# Altium schematic sheet Dimmer.SchDoc
size A4
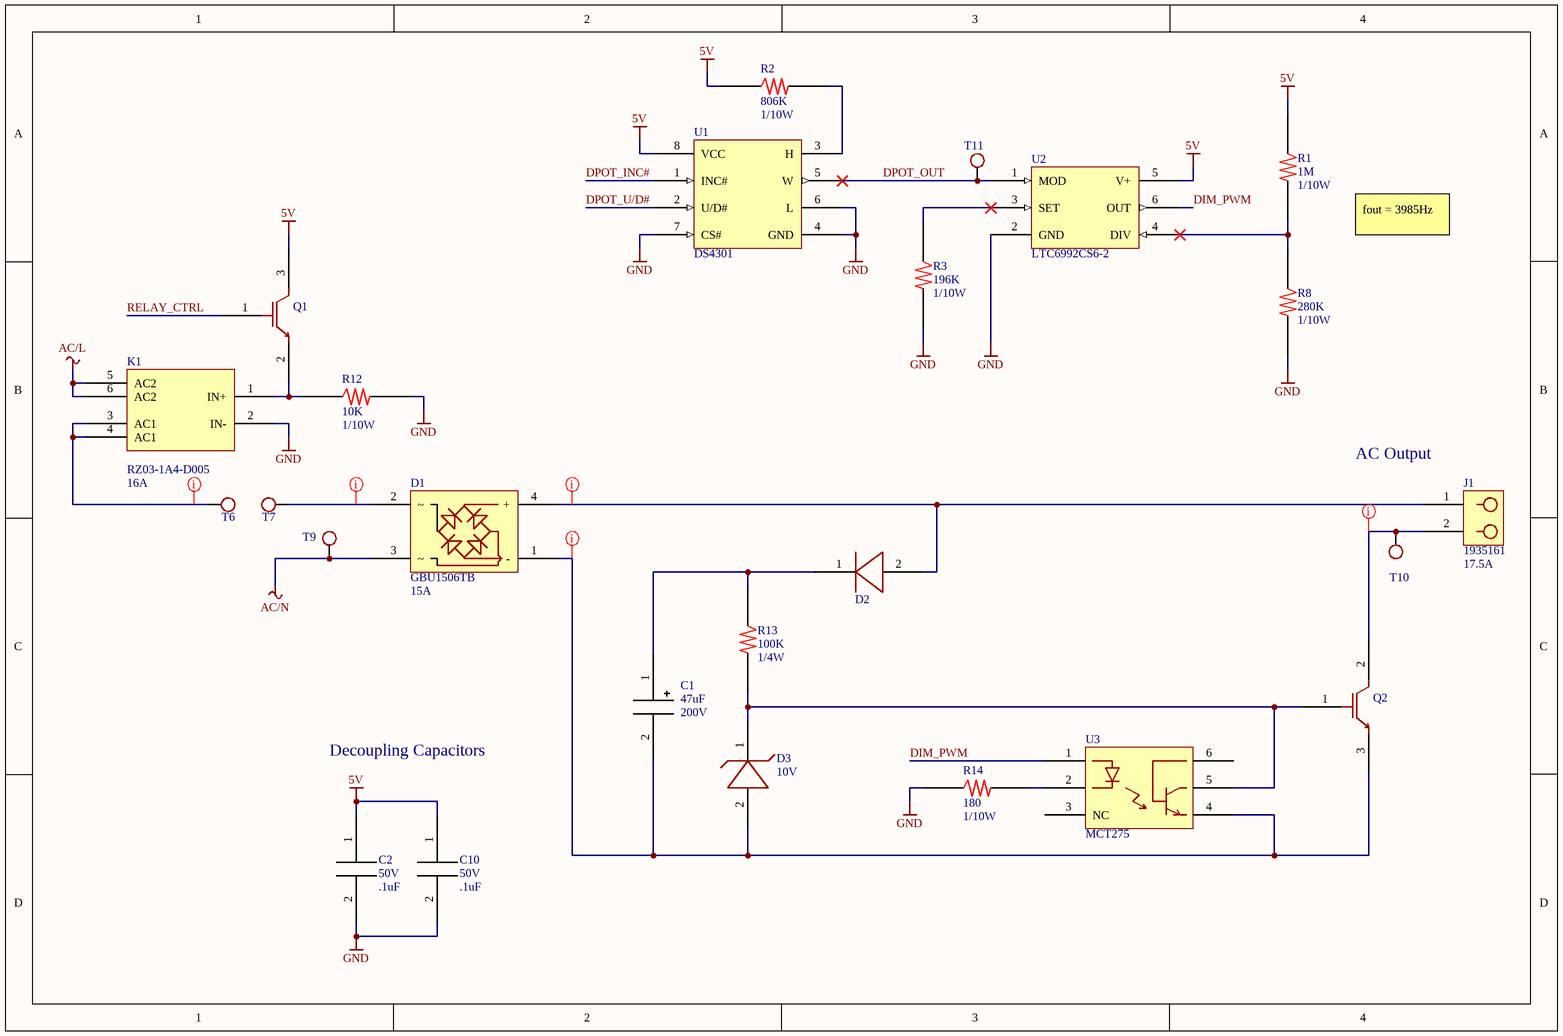
[diagram p0: Dimmer.SchDoc]

## Parts
C1  value 47uF  Rating: 200V  [CAP12.5X20]  (hidden comment: CAP)
C2  value .1uF  Rating: 50V  [0603]  (hidden comment: C_CAP_0603)
C10  value .1uF  Rating: 50V  [0603]  (hidden comment: C_CAP_0603)
D1  Rating: 15A  PartNumber: GBU1506TB  [GBU]  (hidden comment: D_RECTBRIDGE_GBU1506TB)
D2  D_DIODE_SOD123  [SOD123]  (value not drawn)
D3  value 10V  [SOD323]  (hidden comment: D_ZENER_SOD323)
J1  Rating: 17.5A  [1935161]  (hidden comment: J_2POSTERM_1935161)
K1  Rating: 16A  [RZ03-1A4-D005]  (hidden comment: K_RELAY-RZ03-1A4_RZ03-1A4-D005)
Q1  Q_NFET_SOT23  [SOT23]  (value not drawn)
Q2  Q_NFET_TO252  [TO252]  (value not drawn)
R1  value 1M  Rating: 1/10W  [0603]  (hidden comment: R_RES_0603)
R2  value 806K  Rating: 1/10W  [0603]  (hidden comment: R_RES_0603)
R3  value 196K  Rating: 1/10W  [0603]  (hidden comment: R_RES_0603)
R8  value 280K  Rating: 1/10W  [0603]  (hidden comment: R_RES_0603)
R12  value 10K  Rating: 1/10W  [0603]  (hidden comment: R_RES_0603)
R13  value 100K  Rating: 1/4W  [1206]  (hidden comment: R_RES_1206)
R14  value 180  Rating: 1/10W  [0603]  (hidden comment: R_RES_0603)
T6  TESTPOINT  [TESTPOINT3MM]  (value not drawn)
T7  TESTPOINT  [TESTPOINT3MM]  (value not drawn)
T9  TESTPOINT  [TESTPOINT3MM]  (value not drawn)
T10  TESTPOINT  [TESTPOINT3MM]  (value not drawn)
T11  TESTPOINT  [TESTPOINT1MM]  (value not drawn)
U1  PartNumber: DS4301  [MSOP8]  (hidden comment: U_DS4301_MSOP8)
U2  PartNumber: LTC6992CS6-2  [SOT23-6]  (hidden comment: U_LTC6992CS6-2_SOT23-6)
U3  PartNumber: MCT275  [DIP6]  (hidden comment: U_MCT275_DIP6)

## Nets
5V: C2.1 C10.1 Q1.3(D) R1.1 R2.1 U1.8(VCC) U2.5(V+)
AC/L: K1.5(AC2) K1.6(AC2)
AC/N: D1.3 T9.1
GND: C2.2 C10.2 K1.2(IN-) R3.2 R8.2 R12.2 R14.1 U1.4(GND) U1.6(L) U1.7(CS#) U2.2(GND)
DIM_PWM: U2.6(OUT) U3.1
DPOT_INC#: U1.1(INC#)
DPOT_OUT: T11.1 U1.5(W) U2.1(MOD)
DPOT_U/D#: U1.2(U/D#)
RELAY_CTRL: Q1.1(G)
NetC1_1: C1.1 D2.1 R13.1
NetC1_2: C1.2 D1.1(-) D3.2 Q2.3(S) U3.4
NetD1_2: D1.2 T7.1
NetD1_4: D1.4(+) D2.2 J1.1
NetD3_1: D3.1 Q2.1(G) R13.2 U3.5
NetJ1_2: J1.2 Q2.2(D) T10.1
NetK1_1: K1.1(IN+) Q1.2(S) R12.1
NetK1_3: K1.3(AC1) K1.4(AC1) T6.1
NetR1_2: R1.2 R8.1 U2.4(DIV)
NetR2_2: R2.2 U1.3(H)
NetR3_1: R3.1 U2.3(SET)
NetR14_2: R14.2 U3.2

Not connected (* = marked no-connect by the designer): U3 3(NC) 6

## Layout directives
rule Width Constraint [Pref Width = 100mil    Min Width = 100mil    Max Width = 250mil]: NetD1_2, NetK1_3
rule Width Constraint [Pref Width = 100mil    Min Width = 15mil    Max Width = 250mil]: NetC1_2, NetD1_4, NetJ1_2

## Notes on the sheet
- fout = 3985Hz
- (near J1) AC Output
- Decoupling Capacitors

## Library data of the parts
C1 = C_CAP-P_CAP12.5X20: PartNumber: UVR2D470MHD1TO; Manufacturer: Nichicon
C2 C10 = C_CAP_0603: PartNumber: C0603C104K5RACAUTO; Manufacturer: KEMET
D1 = D_RECTBRIDGE_GBU1506TB: Manufacturer: SMC Diode Solutions
D2 = D_DIODE_SOD123: PartNumber: BAS16GWJ; Manufacturer: Nexperia USA Inc; Rating: 215mA
D3 = D_ZENER_SOD323: PartNumber: MM3Z10VT1G; Manufacturer: On Semiconductor; Rating: 300mW
J1 = J_2POSTERM_1935161: Manufacturer: Phoenix Contact; PartNumber: 1935161
K1 = K_RELAY-RZ03-1A4_RZ03-1A4-D005: Manufacturer: TE Connectivity / Potter and Brumfield; PartNumber: RZ03-1A4-D005
Q1 = Q_NFET_SOT23: Manufacturer: On Semiconductor; PartNumber: BSS138; Rating: 220mA
Q2 = Q_NFET_TO252: Manufacturer: Infineon Technologies; PartNumber: IPD50R280CEAUMA1; Rating: 18.1A
R1 = R_RES_0603: PartNumber: RC0603FR-071ML; Manufacturer: Yageo
R3 = R_RES_0603: PartNumber: RC0603FR-07196KL; Manufacturer: Yageo
R8 = R_RES_0603: PartNumber: RC0603FR-07280KL; Manufacturer: Yageo
R12 = R_RES_0603: PartNumber: RC0603JR-0710KL
R13 = R_RES_1206: PartNumber: RC1206JR-07100KL; Manufacturer: Yageo
R14 = R_RES_0603: PartNumber: RC0603JR-07180RL; Manufacturer: Yageo
T6 T7 T9 T10 = T_TESTPOINT_TESTPOINT3MM: Value: 3mm
T11 = T_TESTPOINT_TESTPOINT1MM: Value: 1mm
U1 = U_DS4301_MSOP8: Manufacturer: Maxim; Value: 200K
U3 = U_MCT275_DIP6: Manufacturer: Vishay